# Altium schematic sheet 05_RK3128_VDD.SchDoc
size 297 x 209 mm
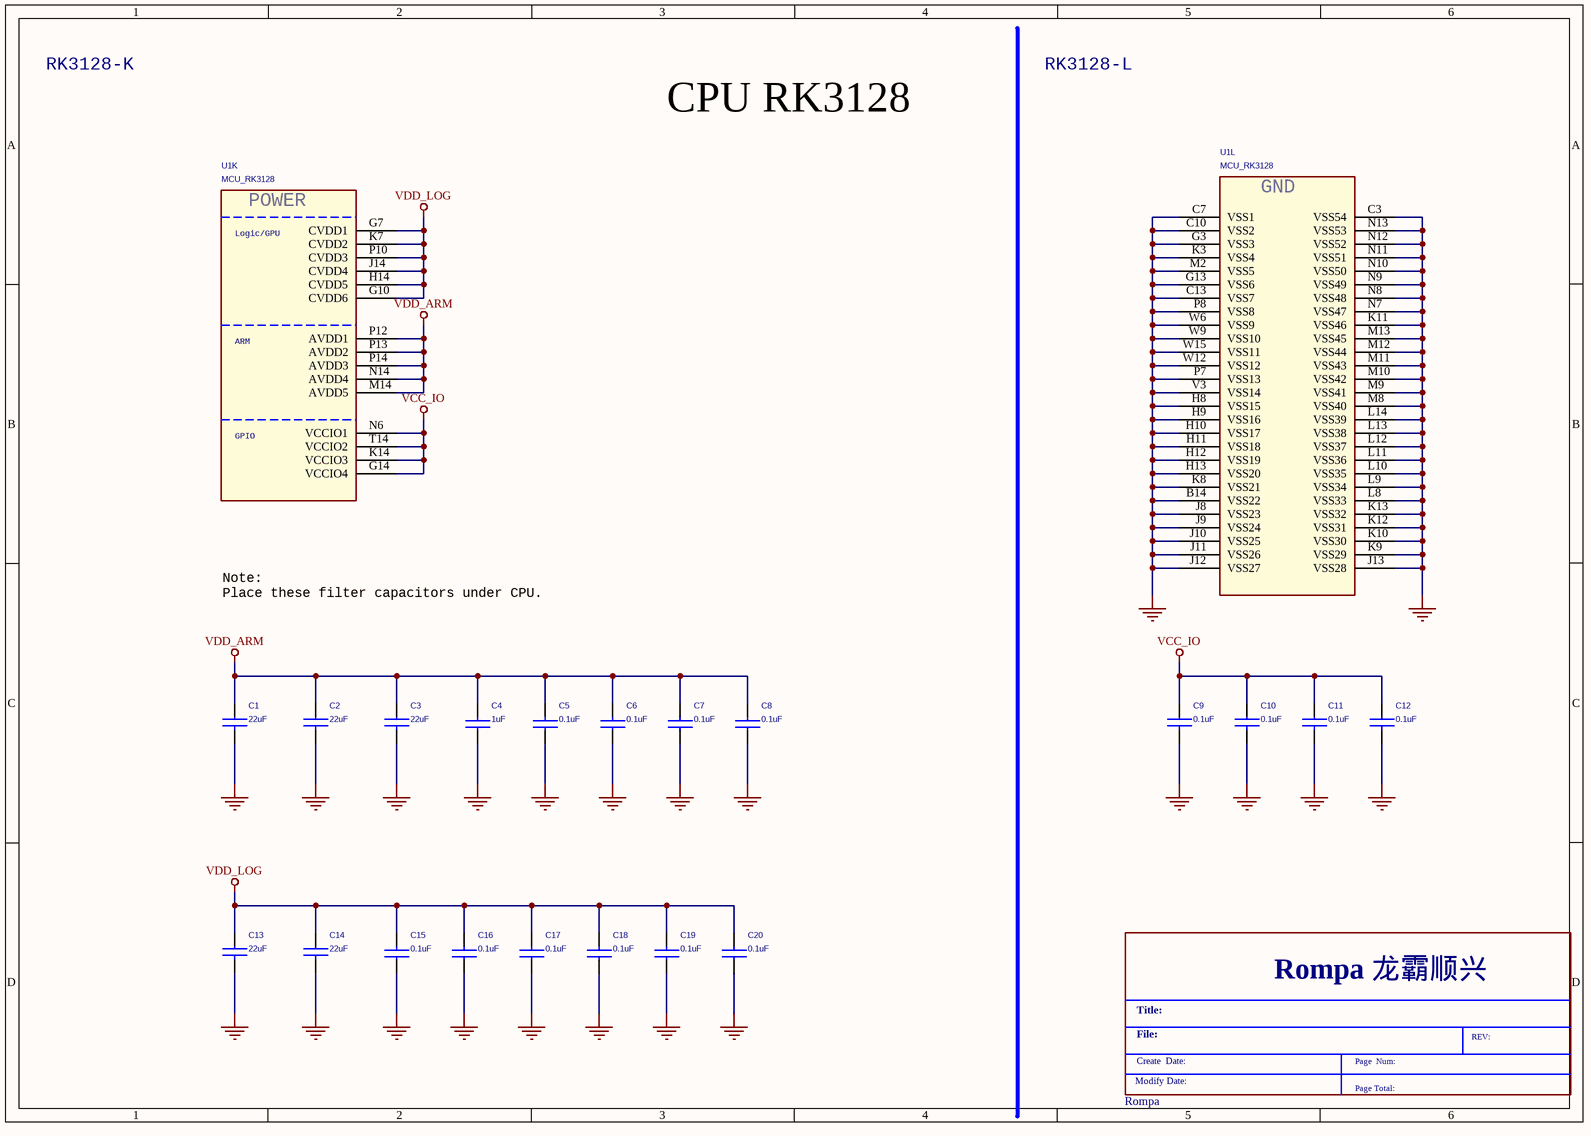
[diagram p0: 05_RK3128_VDD.SchDoc]

## Parts
*  Rompa  (graphical)
C1  22uF  [C0805]
C2  22uF  [C0805]
C3  22uF  [C0805]
C4  1uF  [C0402]
C5  0.1uF  [C0402]
C6  0.1uF  [C0402]
C7  0.1uF  [C0402]
C8  0.1uF  [C0402]
C9  0.1uF  [C0402]
C10  0.1uF  [C0402]
C11  0.1uF  [C0402]
C12  0.1uF  [C0402]
C13  22uF  [C0805]
C14  22uF  [C0805]
C15  0.1uF  [C0402]
C16  0.1uF  [C0402]
C17  0.1uF  [C0402]
C18  0.1uF  [C0402]
C19  0.1uF  [C0402]
C20  0.1uF  [C0402]
U1  MCU_RK3128  [BGA316-14X14-0.65]  (parts K,L of 12)

## Nets
GND: C1.2 C2.2 C3.2 C4.1 C5.1 C6.1 C7.1 C8.1 C9.2 C10.2 C11.2 C12.2 C13.2 C14.2 C15.1 C16.1 C17.1 C18.1 C19.1 C20.1 U1.B14(VSS22) U1.C3(VSS54) U1.C7(VSS1) U1.C10(VSS2) U1.C13(VSS7) U1.G3(VSS3) U1.G13(VSS6) U1.H8(VSS15) U1.H9(VSS16) U1.H10(VSS17) U1.H11(VSS18) U1.H12(VSS19) U1.H13(VSS20) U1.J8(VSS23) U1.J9(VSS24) U1.J10(VSS25) U1.J11(VSS26) U1.J12(VSS27) U1.J13(VSS28) U1.K3(VSS4) U1.K8(VSS21) U1.K9(VSS29) U1.K10(VSS30) U1.K11(VSS46) U1.K12(VSS31) U1.K13(VSS32) U1.L8(VSS33) U1.L9(VSS34) U1.L10(VSS35) U1.L11(VSS36) U1.L12(VSS37) U1.L13(VSS38) U1.L14(VSS39) U1.M2(VSS5) U1.M8(VSS40) U1.M9(VSS41) U1.M10(VSS42) U1.M11(VSS43) U1.M12(VSS44) U1.M13(VSS45) U1.N7(VSS47) U1.N8(VSS48) U1.N9(VSS49) U1.N10(VSS50) U1.N11(VSS51) U1.N12(VSS52) U1.N13(VSS53) U1.P7(VSS13) U1.P8(VSS8) U1.V3(VSS14) U1.W6(VSS9) U1.W9(VSS10) U1.W12(VSS12) U1.W15(VSS11)
VCC_IO: C9.1 C10.1 C11.1 C12.1 U1.G14(VCCIO4) U1.K14(VCCIO3) U1.N6(VCCIO1) U1.T14(VCCIO2)
VDD_ARM: C1.1 C2.1 C3.1 C4.2 C5.2 C6.2 C7.2 C8.2 U1.M14(AVDD5) U1.N14(AVDD4) U1.P12(AVDD1) U1.P13(AVDD2) U1.P14(AVDD3)
VDD_LOG: C13.1 C14.1 C15.2 C16.2 C17.2 C18.2 C19.2 C20.2 U1.G7(CVDD1) U1.G10(CVDD6) U1.H14(CVDD5) U1.J14(CVDD4) U1.K7(CVDD2) U1.P10(CVDD3)

## Notes on the sheet
- RK3128-K
- RK3128-L
- CPU RK3128
- Note:
  Place these filter capacitors under CPU.
- (in symbol MCU_RK3128, part K) POWER; Logic/GPU; ARM; GPIO
- (in symbol MCU_RK3128, part L) GND
- (in symbol Rompa) Rompa 龙霸顺兴; Title:; File:; REV:; Create  Date:; Page  Num:; Modify Date:; Page Total:

## Library data of the parts
C1-C3 C13 C14 = CAP NP: RoHS CHIP CAP 22uF +10/-10% X5R
C4 = CAP NP: RoHS CHIP CAP 1uF +10/-10% X5R
C5-C12 C15-C20 = CAP NP: RoHS CHIP CAP 0.1uF +10/-10% X7R